# EAGLE schematic AlarmClock Schematic (EAGLE 9.7.0)
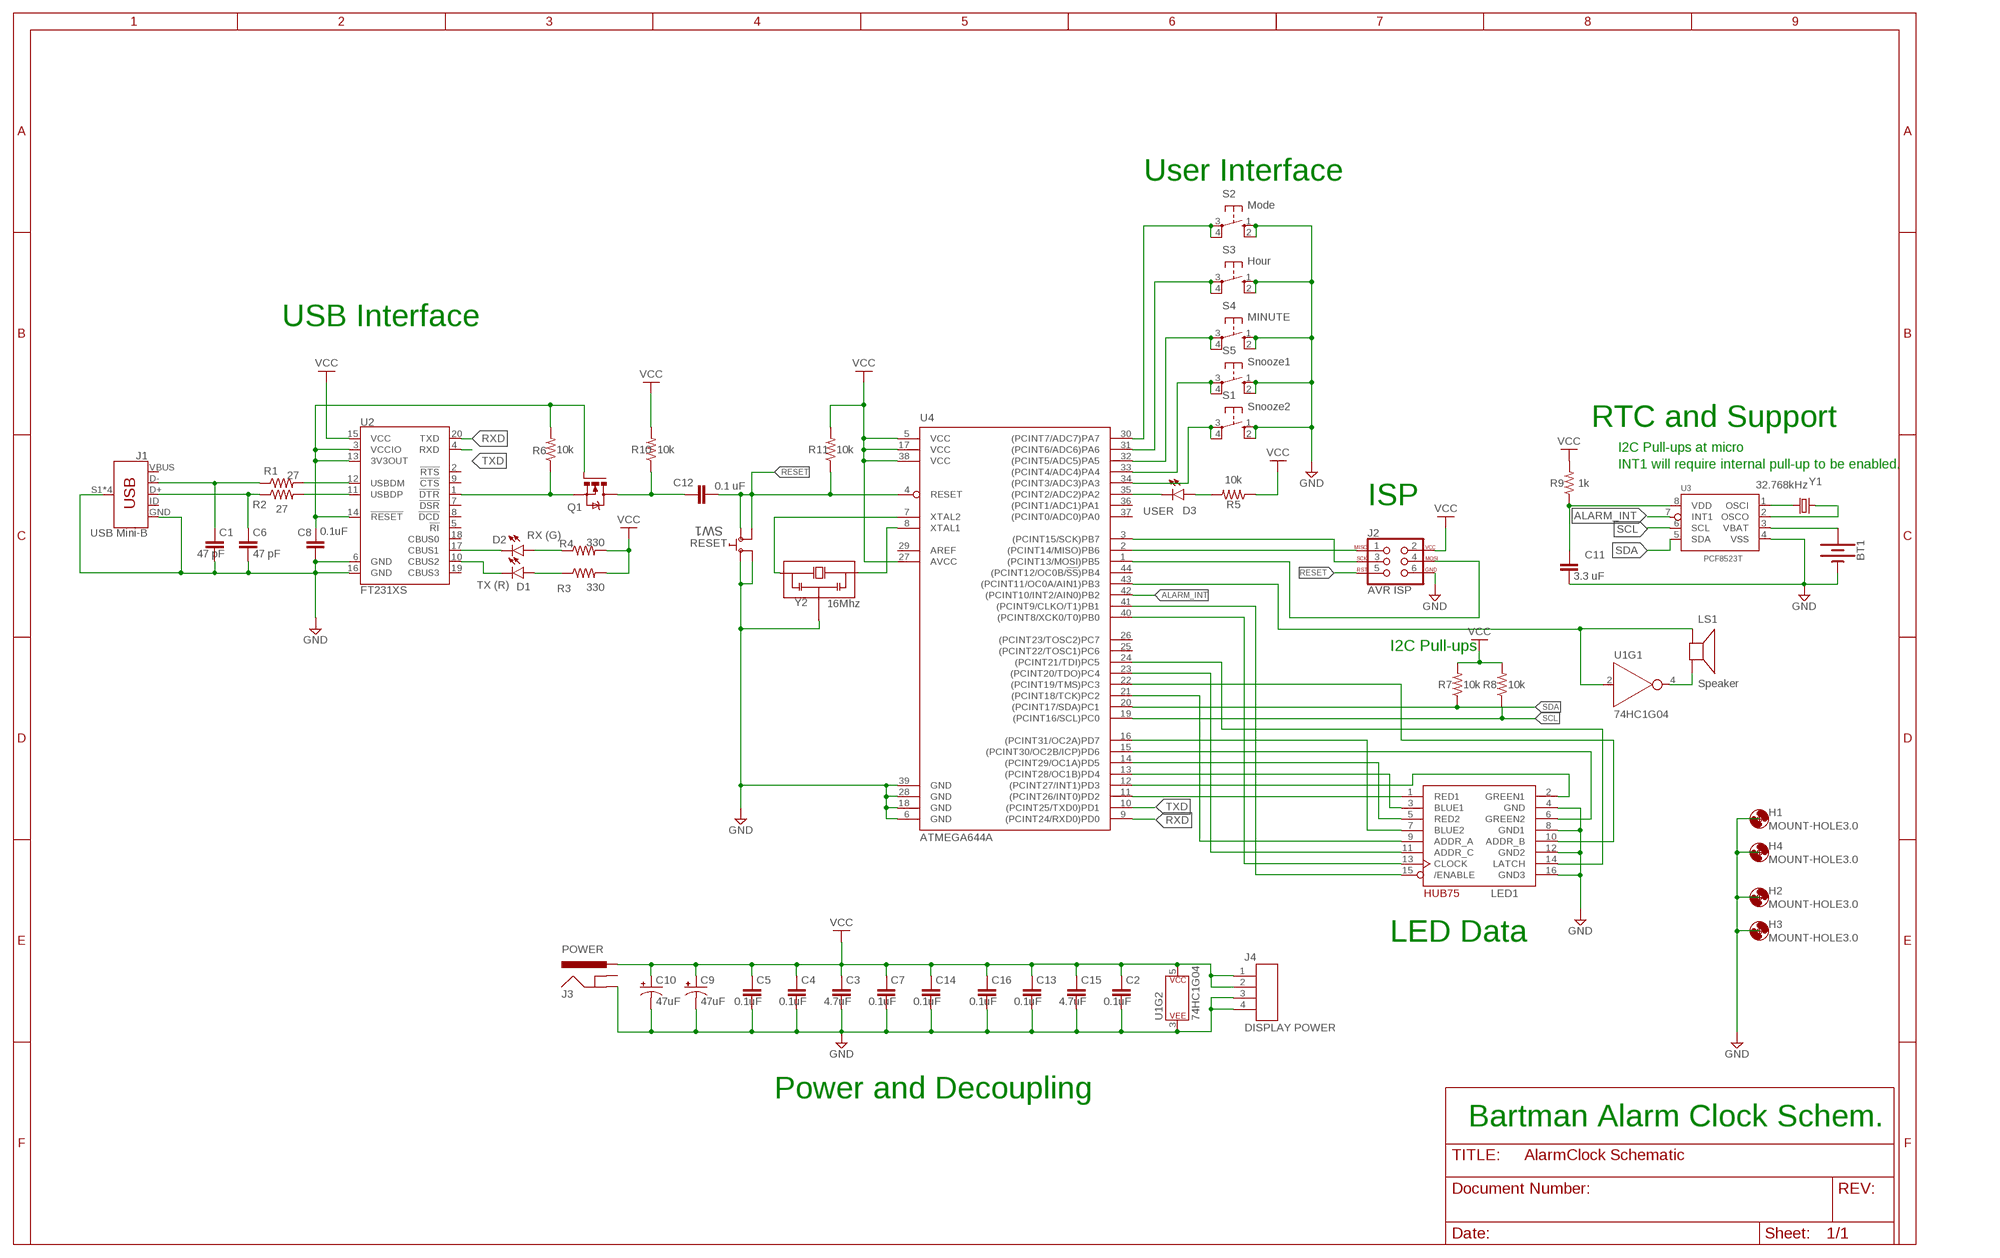
[diagram p0: schematic, sheet 1]

## Parts
BT1  BATTERY-20MM_SMD_4LEGS  [BATTCON_20MM_4LEGS]
C1  47 pF  C_CHIP-0805(2012-METRIC)  [CAPC2012X110]
C2  0.1uF  C_CHIP-0805(2012-METRIC)  [CAPC2012X110]
C3  4.7uF  C_CHIP-0805(2012-METRIC)  [CAPC2012X110]
C4  0.1uF  C_CHIP-0805(2012-METRIC)  [CAPC2012X110]
C5  0.1uF  C_CHIP-0805(2012-METRIC)  [CAPC2012X110]
C6  47 pF  C_CHIP-0805(2012-METRIC)  [CAPC2012X110]
C7  0.1uF  C_CHIP-0805(2012-METRIC)  [CAPC2012X110]
C8  0.1uF  C_CHIP-0805(2012-METRIC)  [CAPC2012X110]
C9  47uF  47UF-POLAR-PANASONIC_D-35V-20%  [PANASONIC_D]
C10  47uF  47UF-POLAR-PANASONIC_D-35V-20%  [PANASONIC_D]
C11  3.3 uF  C_CHIP-0805(2012-METRIC)  [CAPC2012X110]
C12  0.1 uF  C_CHIP-0805(2012-METRIC)  [CAPC2012X110]
C13  0.1uF  C_CHIP-0805(2012-METRIC)  [CAPC2012X110]
C14  0.1uF  C_CHIP-0805(2012-METRIC)  [CAPC2012X110]
C15  4.7uF  C_CHIP-0805(2012-METRIC)  [CAPC2012X110]
C16  0.1uF  C_CHIP-0805(2012-METRIC)  [CAPC2012X110]
D1  TX (R)  LED_CHIPRED-2012  [LEDC2012X110N_R]
D2  RX (G)  LED_CHIPGREEN-2012  [LEDC2012X110N_G]
D3  USER  LED_CHIPRED-2012  [LEDC2012X110N_R]
H1  MOUNT-HOLE3.0  [3,0]
H2  MOUNT-HOLE3.0  [3,0]
H3  MOUNT-HOLE3.0  [3,0]
H4  MOUNT-HOLE3.0  [3,0]
J1  USB Mini-B  USB_MINI-B_SMT  [USB-MINIB]
J2  AVR ISP  AVR_SPI_PROG_3X2PTH  [2X3]
J3  POWER  POWER_JACKPTH_BREAD  [POWER_JACK_PTH_BREAD]
J4  DISPLAY POWER  B4P-VH(LF)(SN)  [JST_B4P-VH(LF)(SN)]
LED1  HUB75MATRIX  [2X08-IDC]
LS1  Speaker  CPT-1625-80-SMT-TR  [XDCR_CPT-1625-80-SMT-TR]
Q1  BSS123  NMOSFET_BSS123-SOT23  [SOT23]
R1  27  R-US_CHIP-0805(2012-METRIC)  [RESC2012X65]
R2  27  R-US_CHIP-0805(2012-METRIC)  [RESC2012X65]
R3  330  R-US_CHIP-0805(2012-METRIC)  [RESC2012X65]
R4  330  R-US_CHIP-0805(2012-METRIC)  [RESC2012X65]
R5  10k  R-US_CHIP-0805(2012-METRIC)  [RESC2012X65]
R6  10k  R-US_CHIP-0805(2012-METRIC)  [RESC2012X65]
R7  10k  R-US_CHIP-0805(2012-METRIC)  [RESC2012X65]
R8  10k  R-US_CHIP-0805(2012-METRIC)  [RESC2012X65]
R9  1k  R-US_CHIP-0805(2012-METRIC)  [RESC2012X65]
R10  10k  R-US_CHIP-0805(2012-METRIC)  [RESC2012X65]
R11  10k  R-US_CHIP-0805(2012-METRIC)  [RESC2012X65]
S1  Snooze2  B3F-1052  [B3F-10XX]
S2  Mode  B3F-1052  [B3F-10XX]
S3  Hour  B3F-1052  [B3F-10XX]
S4  MINUTE  B3F-1052  [B3F-10XX]
S5  Snooze1  B3F-1052  [B3F-10XX]
SW1  FSM2JSMAA  [SWITCH_FSM2JSMAA]
U1  74HC1G04  [SOT353]
U2  FT231XS  [SSOP20_L]
U3  PCF8523T  [SOT96-1]
U4  ATMEGA644A  [TQFP44]
Y1  32.768kHz  CRYSTAL-32.768KHZSMD-MC146  [CRYSTAL-SMD-MC-146]
Y2  16Mhz  CSTNE16M0V530000R0  [CSTNE_3SMD]

## Nets
ALARM_INT: U3.7(INT1) U4.42((PCINT10/INT2/AIN0)PB2)
GND: BT1.NEGATIVE(-) C1.2 C2.2 C3.2 C4.2 C5.2 C6.2 C7.2 C8.2 C9.- C10.- C11.2 C13.2 C14.2 C15.2 C16.2 J1.GND J1.S1(SHIELD) J1.S2(SHIELD) J1.S3(SHIELD) J1.S4(SHIELD) J2.6 J3.GND J4.3 J4.4 LED1.4(GND) LED1.8(GND1) LED1.12(GND2) LED1.16(GND3) S1.1(S) S1.2(S1) S2.1(S) S2.2(S1) S3.1(S) S3.2(S1) S4.1(S) S4.2(S1) S5.1(S) S5.2(S1) SW1.1 SW1.2 U1.3(P$V-) U2.6(GND) U2.16(GND) U3.4(VSS) U4.6(GND) U4.18(GND) U4.28(GND) U4.39(GND) Y2.2
N$1: R1.2 U2.12(USBDM)
N$2: R2.2 U2.11(USBDP)
N$3: C8.1 Q1.1(G) R6.2 U2.3(VCCIO) U2.13(3V3OUT) U2.14(!RESET)
N$4: C6.1 J1.D+ R2.1
N$5: C1.1 J1.D- R1.1
N$6: Q1.2(S) R6.1 U2.1(!DTR)
N$7: D2.2(A) R4.1
N$8: U4.7(XTAL2) Y2.1
N$9: D2.1(C) U2.17(CBUS1)
N$10: D1.1(C) U2.10(CBUS2)
N$11: C12.1 Q1.3(D) R10.1
N$12: S2.3(P) S2.4(P1) U4.30((PCINT7/ADC7)PA7)
N$13: U4.8(XTAL1) Y2.3
N$14: D1.2(A) R3.1
N$15: C11.1 R9.1 U3.8(VDD)
N$16: BT1.POSITIVE@1(+) BT1.POSITIVE@2(+) BT1.POSITIVE@3(+) BT1.POSITIVE@4(+) U3.3(VBAT)
N$17: U3.1(OSCI) Y1.P$1
N$18: U3.2(OSCO) Y1.P$2
N$19: J2.1 U4.2((PCINT14/MISO)PB6)
N$20: J2.3 U4.3((PCINT15/SCK)PB7)
N$21: J2.4 U4.1((PCINT13/MOSI)PB5)
N$22: D3.2(A) R5.2
N$23: LED1.1(RED1) U4.11((PCINT26/INT0)PD2)
N$24: D3.1(C) U4.35((PCINT2/ADC2)PA2)
N$25: LED1.3(BLUE1) U4.13((PCINT28/OC1B)PD4)
N$26: LED1.5(RED2) U4.14((PCINT29/OC1A)PD5)
N$27: LED1.7(BLUE2) U4.16((PCINT31/OC2A)PD7)
N$28: LED1.9(ADDR_A) U4.21((PCINT18/TCK)PC2)
N$29: LED1.11(ADDR_C) U4.23((PCINT20/TDO)PC4)
N$30: LED1.13(CLOCK) U4.40((PCINT8/XCK0/T0)PB0)
N$31: LED1.15(/ENABLE) U4.41((PCINT9/CLKO/T1)PB1)
N$32: LED1.2(GREEN1) U4.12((PCINT27/INT1)PD3)
N$33: LED1.6(GREEN2) U4.15((PCINT30/OC2B/ICP)PD6)
N$34: LED1.14(LATCH) U4.24((PCINT21/TDI)PC5)
N$35: LED1.10(ADDR_B) U4.22((PCINT19/TMS)PC3)
N$36: LS1.N U1.4(Y)
N$37: LS1.P U1.2(A) U4.43((PCINT11/OC0A/AIN1)PB3)
N$38: S5.3(P) S5.4(P1) U4.33((PCINT4/ADC4)PA4)
N$39: S3.3(P) S3.4(P1) U4.31((PCINT6/ADC6)PA6)
N$40: S4.3(P) S4.4(P1) U4.32((PCINT5/ADC5)PA5)
N$41: S1.3(P) S1.4(P1) U4.34((PCINT3/ADC3)PA3)
RESET: C12.2 J2.5 R11.1 SW1.3 SW1.4 U4.4(RESET)
RXD: U2.20(TXD) U4.9((PCINT24/RXD0)PD0)
SCL: R8.1 U3.6(SCL) U4.19((PCINT16/SCL)PC0)
SDA: R7.1 U3.5(SDA) U4.20((PCINT17/SDA)PC1)
TXD: U2.4(RXD) U4.10((PCINT25/TXD0)PD1)
VCC: C2.1 C3.1 C4.1 C5.1 C7.1 C9.+ C10.+ C13.1 C14.1 C15.1 C16.1 J2.2 J3.PWR J4.1 J4.2 R3.2 R4.2 R5.1 R7.2 R8.2 R9.2 R10.2 R11.2 U1.5(P$V+) U2.15(VCC) U4.5(VCC) U4.17(VCC) U4.27(AVCC) U4.38(VCC)
Unconnected: J1.ID J3.GNDBREAK U2.2(!RTS) U2.5(!RI) U2.7(!DSR) U2.8(!DCD) U2.9(!CTS) U2.18(CBUS0) U2.19(CBUS3) U4.25((PCINT22/TOSC1)PC6) U4.26((PCINT23/TOSC2)PC7) U4.29(AREF) U4.36((PCINT1/ADC1)PA1) U4.37((PCINT0/ADC0)PA0) U4.44((PCINT12/OC0B/!SS!)PB4)

## Notes on the sheet
- User Interface
- USB Interface
- RTC and Support
- I2C Pull-ups at micro
- INT1 will require internal pull-up to be enabled.
- ISP
- I2C Pull-ups
- LED Data
- Power and Decoupling
- Bartman Alarm Clock Schem.

## Power pins joined to a net without a drawn wire
VBUS: J1.VBUS

## Library data of the parts
BT1 = SparkFun-Batteries:BATTERY: Battery - Single Cell A variety of battery chemistries, sizes, and footprints. Device List: 20MM_PTH - Coin Cell Battery Holder - 20mm (PTH) <https://www.sparkfun.com/products/783> 6.8MM_PTH - Coin Cell Battery Holder - 6.8MM(SMD) <https://www.digikey.com/product-detail/en/seiko-instruments/MS621FE-FL11E/728-1057-ND/1889208?WT.srch=1&gclid=CNOQ5a6LzdQCFZS2wAodXCkE0g> 12MM_SMD - Coin Cell Battery Holder - 12mm (SMD) <https://www.sparkfun.com/products/10592> 12MM_PTH - Coin Cell Battery Holder - 12mm (PTH) <https://www.sparkfun.com/products/7948> 20MM_SMD - 20mm Coin Cell Battery Holder (SMD) (2 legs) Used on the Big Time Watch Kit <https://www.sparkfun.com/products/11734> 20MM_SMD_4LEGS - Coin Cell Battery Holder - 20mm (SMD) <https://www.sparkfun.com/products/11892> 20MM_SMD_4LEGS_OVERPASTE - Coin Cell Battery Holder - 20mm (SMD) <https://www.sparkfun.com/products/11892> (Over-paste on the legs) 24.5MM_PTH - Coin Cell Battery Holder - 24.5mm (PTH) <https://www.sparkfun.com/products/8863> 9V - 9V Battery Holder - PC Mount Used on the SparkFun SparkPunk Sound Kit <https://www.sparkfun.com/products/11177> and SparkFun SparkPunk Sequencer Kit <https://www.sparkfun.com/products/12707> 18650 - Battery Holder - 18650 (PTH) <https://www.sparkfun.com/products/13113> AA - Battery Holder - 1xAA (PTH) <https://www.sparkfun.com/products/7949> AAA - Battery Holder - 1xAAA (PTH) <https://www.sparkfun.com/products/12718> AA_KIT - Battery Holder - 1xAA (PTH) <https://www.sparkfun.com/products/7949> Special kit package - pads only have exposed copper on one side of the board. AAA_KIT - Battery Holder - 1xAAA (PTH) <https://www.sparkfun.com/products/12718> Special kit package - pads only have exposed copper on one side of the board.; PROD_ID: BATT-10373; SF_SKU: PRT-11892
C1-C8 C11-C16 = Capacitor:C: Capacitor - Generic; CATEGORY: Capacitor
C9 C10 = SparkFun-Capacitors:47UF-POLAR: 47µF polarized capacitors A capacitor is a passive two-terminal electrical component used to store electrical energy temporarily in an electric field.; PROD_ID: CAP-08478
D1 D3 = Opto-Electronic:LED_CHIP: LED - Generic; CATEGORY: Opto-Electronic; COLOR: RED; SUB-CATEGORY: LED; VALUE: LED_RED
D2 = Opto-Electronic:LED_CHIP: LED - Generic; CATEGORY: Opto-Electronic; COLOR: RX (G); SUB-CATEGORY: LED; VALUE: LED_GREEN
H1-H4 = holes:MOUNT-HOLE: MOUNTING HOLE with drill center marker
J1 = CE4100:USB_MINI-B: Modified from SparkFun Mini-B to fit Molex 0675031020.; PROD_ID: CONN-08193; SF_ID: PRT-00587
J2 = SparkFun-Connectors:AVR_SPI_PROG_3X2: AVR ISP 6 Pin This is the reduced ISP connector for AVR programming. Common on Arduino. This footprint will take up less PCB space and can be used with a 10-pin to 6-pin adapter such as SKU: BOB-08508 **Special note about "TEST_POINT" package. The stop mask is on the top side, so if you want your programming test points to be on the bottom of your board, make sure to place this package on the bottom side of the board. This also ensure that the orientation to program from the bottom side will be correct. SparkFun Products: SparkFun ISP Pogo Adapter <https://www.sparkfun.com/products/11591> - NS Tiny AVR Programmer <https://www.sparkfun.com/products/11801> -PTH
J3 = SparkFun-Connectors:POWER_JACK: Power Jack Connector This is the standard 5.5mm barrel jack for power. The PTH is the most common, proven, reliable, footprint. The Slot footprint only works if the mill layer is transmitted to the PCB fab house so be warned. Here are the connectors we sell at SparkFun: DC Barrel Power Jack/Connector <https://www.sparkfun.com/products/119> (PRT-00119) DC Barrel Power Jack/Connector (SMD) <https://www.sparkfun.com/products/12748> (PRT-12748) DC Barrel Jack Adapter - Breadboard Compatible <https://www.sparkfun.com/products/10811> (PRT-10811) It is used on this SparkFun product (and many, many others): SparkFun RedBoard - Programmed with Arduino <https://www.sparkfun.com/products/12757> (DEV-12757) Also, if you need a mating power supply or connector, please check these out: Wall Adapter Power Supply - 9VDC 650mA <https://www.sparkfun.com/products/298> (TOL-00298) DC Barrel Jack Adapter - Male <https://www.sparkfun.com/products/10287> (PRT-10287); PROD_ID: PRT-10811
J4 = B4P-VH_LF__SN_:B4P-VH(LF)(SN): VH Series 4 Position 3.96 mm Pitch Top Entry Locking Header; MANUFACTURER: JST Sales; MAXIMUM_PACKAGE_HEIGHT: 10.9mm; STANDARD: Manufacturer Recommendations
LED1 = adafruit:HUB75MATRIX
LS1 = CPT-1625-80-SMT-TR:CPT-1625-80-SMT-TR; CUI_PURCHASE_URL: https://www.cuidevices.com/product/audio/buzzers/audio-transducers/cpt-1625-80-smt-tr?utm_source=snapeda.com&utm_medium=referral&utm_campaign=snapedaBOM; DESCRIPTION: 16.8 mm, 5 Vp-p, 80 dB, Surface Mount (SMT), Piezo Audio Transducer Buzzer; DIGI-KEY_PART_NUMBER: 102-CPT-1625-80-SMT-CT-ND; MF: CUI Devices; MP: CPT-1625-80-SMT-TR; PACKAGE: CUI Devices; PURCHASE-URL: https://pricing.snapeda.com/search/part/CPT-1625-80-SMT-TR/?ref=eda
Q1 = Transistor:NMOSFET_: N-Channel MOSFET - Popular parts; CATEGORY: Transistor; DESCRIPTION: MOSFET N-CH 100V 0.17A SOT-23; DRAIN_CURRENT: 170mA; MANUFACTURER: ON Semiconductor; MPN: BSS123L; OPERATING_TEMP: -55°C ~ 150°C; PART_STATUS: Active; ROHS_COMPLIANT: Yes; SUB-CATEGORY: MOSFET; THERMALLOSS: 360mW; TYPE: N-Channel
R1-R11 = Resistor:R-US: Resistor Fixed - ANSI; CATEGORY: Resistor; SUB-CATEGORY: Fixed
S1-S5 = B3F-1052:B3F-1052: OMRON SWITCH 1.1mm holes; DESCRIPTION: Tactile Switch; DIGI-KEY_PART_NUMBER: 39-B3F-1052-G-ND; MF: Omron; MP: B3F-1052; PACKAGE: None; PURCHASE-URL: https://pricing.snapeda.com/search/part/B3F-1052/?ref=eda
SW1 = CE4100:FSM2JSMAA; MANUFACTURER_PART_NUMBER: FSM2JSMAA; RESET: RESET; VENDOR: Tyco Electronics
U1 = SparkFun-IC-Logic:74*1G04: Single Inverter IC NOT GATE INVERTER SNGL 1IN SOT353 Supply: 1.65V to 5.5V Datasheet <http://diodes.com/datasheets/74LVC1G04.pdf> SparkFun Products SparkFun Stepoko <https://www.sparkfun.com/products/13899> (ROB-13899) SparkFun CryptoShield <https://www.sparkfun.com/products/13183> (DEV-13183) SparkFun LogicBlocks Kit <https://www.sparkfun.com/products/11006> (KIT-11006) SparkFun ArduMoto <https://www.sparkfun.com/products/9815> (DEV-09815); PROD_ID: COMP-08268
U2 = SparkFun-IC-Comms:FT231X: FTDI FT231X Full Speed USB to Full-handshake UART This USB2.0 Full Speed IC offers a compact bridge to full handshake UART interfaces. The device is a UART, capable of operating up to 3MBaud, with low power consumption (8mA). The FT231X includes the complete FT-X series feature set and enables USB to be added into a system design quickly and easily over a UART interface. Datasheet <http://cdn.sparkfun.com/datasheets/Components/General%20IC/DS_FT231X.pdf> SparkFun Products SparkFun RedBoard - Programmed with Arduino <https://www.sparkfun.com/products/12757> (DEV-12757) SparkFun XBee Explorer USB <https://www.sparkfun.com/products/11812> (WRL-11812) SparkFun XBee Explorer Dongle <https://www.sparkfun.com/products/11697> (WRL-11697) SparkFun Blynk Board - ESP8266 <https://www.sparkfun.com/products/13794> (WRL-13794) SparkFun ESP8266 Thing - Dev Board <https://www.sparkfun.com/products/13711> (WRL-13711) SparkFun Block for Intel® Edison - Base <https://www.sparkfun.com/products/13045> (DEV-13045) SparkFun RedStick <https://www.sparkfun.com/products/13741> (DEV-13741) SparkFun Beefy 3 - FTDI Basic Breakout <https://www.sparkfun.com/products/13746> (DEV-13746) SparkFun FT231X Breakout <https://www.sparkfun.com/products/11736> (BOB-11736); PROD_ID: IC-11524
U3 = nxp_60:PCF8523: The PCF8523 is a CMOS Real-Time Clock (RTC) and calendar optimized for low power consumption. Data is transferred serially via an I2C-bus with a maximum data rate of 1000 kbit/s. Alarm and timer functions are available with the possibility to generate a wake-up signal on an interrupt pin. An offset register allows fine-tuning of the clock. The PCF8523 has a backup battery switch-over circuit, which detects power failures and automatically switches to the battery supply when a power failure occurs. AAL Eindhoven MK
U4 = atmel:ATMEGA644: 8-bit Microcontroller with 64K Bytes In-System Programmable Flash Source: http://www.atmel.com/dyn/resources/prod_documents/doc2593.pdf; MPN: ATMEGA644PV-10AU; OC_FARNELL: 1455123; OC_NEWARK: 58M3748
Y1 = SparkFun-Clocks:CRYSTAL-32.768KHZ: 32.768kHz Crystal Frequency: 32.768kHz Frequency Stability: ±20ppm Load Capacitance: 12.5pF (PTH-2X6 & SMD-3.2X1.5), 6pF (SMD-2X6) SparkFun Products: SparkFun BigTime Watch Kit <https://www.sparkfun.com/products/11734> SparkFun nRF52832 Breakout <https://www.sparkfun.com/products/13990> SparkFun Real Time Clock Module <https://www.sparkfun.com/products/12708>; PROD_ID: XTAL-09342
Y2 = RESONATOR:CSTNE16M0V530000R0; FREQUENCY: 16Mhz